# EAGLE schematic KitchenTimer-main (EAGLE 6.0)
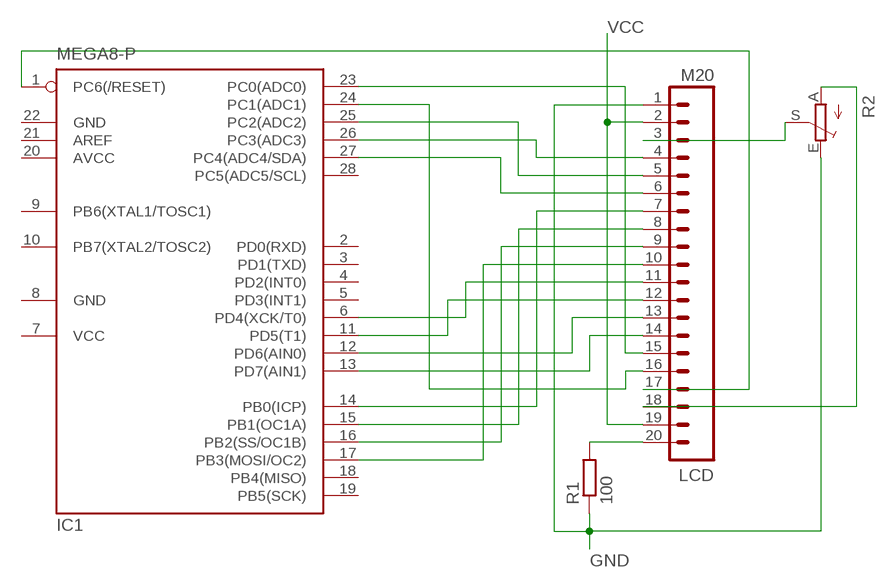
[diagram p0: schematic, sheet 1]

## Parts
IC1  MEGA8-P  [DIL28-3]
LCD  M20  [1X20]
R1  100  R-EU_0204/5  [0204/5]
R2  TRIM_EU-B25P  [B25P]

## Nets
GND: LCD.1 R1.1 R2.E
N$1: LCD.3 R2.S
N$2: LCD.20 R1.2
N$3: IC1.26(PC3(ADC3)) LCD.4
N$4: LCD.18 R2.A
N$5: IC1.25(PC2(ADC2)) LCD.5
N$6: IC1.27(PC4(ADC4/SDA)) LCD.6
N$7: IC1.14(PB0(ICP)) LCD.7
N$8: IC1.15(PB1(OC1A)) LCD.8
N$9: IC1.16(PB2(SS/OC1B)) LCD.9
N$10: IC1.17(PB3(MOSI/OC2)) LCD.10
N$11: IC1.6(PD4(XCK/T0)) LCD.11
N$12: IC1.11(PD5(T1)) LCD.12
N$13: IC1.12(PD6(AIN0)) LCD.13
N$14: IC1.13(PD7(AIN1)) LCD.14
N$15: IC1.23(PC0(ADC0)) LCD.15
N$16: IC1.24(PC1(ADC1)) LCD.16
N$17: IC1.1(PC6(/RESET)) LCD.17
VCC: LCD.2 LCD.19
Unconnected: IC1.2(PD0(RXD)) IC1.3(PD1(TXD)) IC1.4(PD2(INT0)) IC1.5(PD3(INT1)) IC1.9(PB6(XTAL1/TOSC1)) IC1.10(PB7(XTAL2/TOSC2)) IC1.18(PB4(MISO)) IC1.19(PB5(SCK)) IC1.21(AREF) IC1.28(PC5(ADC5/SCL))

## Power pins joined to a net without a drawn wire
AVCC: IC1.20(AVCC)
GND: IC1.8(GND) IC1.22(GND)
VCC: IC1.7(VCC)

## Library data of the parts
IC1 = atmel:MEGA8-P: MICROCONTROLLER 8 Kbytes FLASH, 1 kbytes SRAM, 512 bytes EEPROM, USART, 4-channel 10 bit ADC, 2-channel 8 bit ADC Pin compatible with Atmega48, ATMega88, ATMega168 Source: avr.lbr; OC_FARNELL: unknown; OC_NEWARK: unknown
LCD = SparkFun:M20: This is just like the LOCK variant in that the holes are staggared by 5 mil, but except for the last two holes. They are not altered from the "standard" footprint layout. This is used for a special purpose on the layout of our Graphic LCD Backpack. Make sure you want to use this device before selecting it for you project!
R1 = resistor:R-EU_: RESISTOR, European symbol
R2 = pot:TRIM_EU-: POTENTIOMETER